# EAGLE design Nintendo64 (EAGLE 9.6.2)
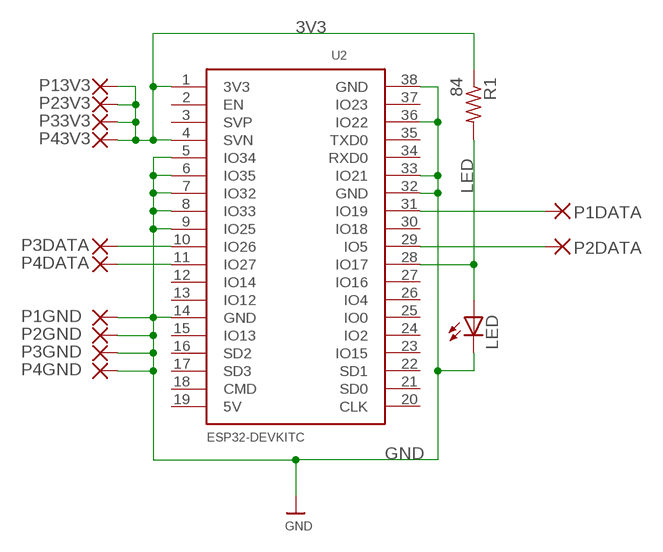
[diagram p0: schematic, sheet 1]

## Parts
LED  LEDCHIPLED_1206  [CHIPLED_1206]
P1DATA  SMD5  [SMD2,54-5,08]
P1GND  SMD5  [SMD2,54-5,08]
P2DATA  SMD5  [SMD2,54-5,08]
P2GND  SMD5  [SMD2,54-5,08]
P3DATA  SMD5  [SMD2,54-5,08]
P3GND  SMD5  [SMD2,54-5,08]
P4DATA  SMD5  [SMD2,54-5,08]
P4GND  SMD5  [SMD2,54-5,08]
P13V3  SMD5  [SMD2,54-5,08]
P23V3  SMD5  [SMD2,54-5,08]
P33V3  SMD5  [SMD2,54-5,08]
P43V3  SMD5  [SMD2,54-5,08]
R1  84  R-US_R1206  [R1206]
U2  ESP32DEVKITC  [ESP32-DEVKITC]

## Nets
3V3: P13V3.1(P) P23V3.1(P) P33V3.1(P) P43V3.1(P) R1.1 U2.1(3V3) U2.4(SVN)
GND: LED.C P1GND.1(P) P2GND.1(P) P3GND.1(P) P4GND.1(P) U2.5(IO34) U2.6(IO35) U2.7(IO32) U2.8(IO33) U2.9(IO25) U2.14(GND) U2.32(GND) U2.33(IO21) U2.36(IO22) U2.38(GND)
LED: LED.A R1.2 U2.28(IO17)
P1DATA: P1DATA.1(P) U2.31(IO19)
P2DATA: P2DATA.1(P) U2.29(IO5)
P3DATA: P3DATA.1(P) U2.10(IO26)
P4DATA: P4DATA.1(P) U2.11(IO27)
Unconnected: U2.2(EN) U2.3(SVP) U2.12(IO14) U2.13(IO12) U2.15(IO13) U2.16(SD2) U2.17(SD3) U2.18(CMD) U2.19(5V) U2.20(CLK) U2.21(SD0) U2.22(SD1) U2.23(IO15) U2.24(IO2) U2.25(IO0) U2.26(IO4) U2.27(IO16) U2.30(IO18) U2.34(RXD0) U2.35(TXD0) U2.37(IO23)

## Library data of the parts
LED = adafruit:LED: LED OSRAM: - CHIPLED LG R971, LG N971, LY N971, LG Q971, LY Q971, LO R971, LY R971 LH N974, LH R974 LS Q976, LO Q976, LY Q976 LO Q996 - Hyper CHIPLED LW Q18S LB Q993, LB Q99A, LB R99A - SideLED LS A670, LO A670, LY A670, LG A670, LP A670 LB A673, LV A673, LT A673, LW A673 LH A674 LY A675 LS A676, LA A676, LO A676, LY A676, LW A676 LS A679, LY A679, LG A679 - Hyper Micro SIDELED® LS Y876, LA Y876, LO Y876, LY Y876 LT Y87S - SmartLED LW L88C, LW L88S LB L89C, LB L89S, LG L890 LS L89K, LO L89K, LY L89K LS L896, LA L896, LO L896, LY L896 - TOPLED LS T670, LO T670, LY T670, LG T670, LP T670 LSG T670, LSP T670, LSY T670, LOP T670, LYG T670 LG T671, LOG T671, LSG T671 LB T673, LV T673, LT T673, LW T673 LH T674 LS T676, LA T676, LO T676, LY T676, LB T676, LH T676, LSB T676, LW T676 LB T67C, LV T67C, LT T67C, LS T67K, LO T67K, LY T67K, LW E67C LS E67B, LA E67B, LO E67B, LY E67B, LB E67C, LV E67C, LT E67C LW T67C LS T679, LY T679, LG T679 LS T770, LO T770, LY T770, LG T770, LP T770 LB T773, LV T773, LT T773, LW T773 LH T774 LS E675, LA E675, LY E675, LS T675 LS T776, LA T776, LO T776, LY T776, LB T776 LHGB T686 LT T68C, LB T68C - Hyper Mini TOPLED® LB M676 - Mini TOPLED Santana® LG M470 LS M47K, LO M47K, LY M47K Source: http://www.osram.convergy.de/
P1DATA P1GND P2DATA P2GND P3DATA P3GND P4DATA P4GND P13V3 P23V3 P33V3 P43V3 = wirepad:SMD5: SMD PAD
R1 = adafruit:R-US_: RESISTOR, American symbol
U2 = ESP32-DEVKITC4:ESP32DEVKITC

## Board
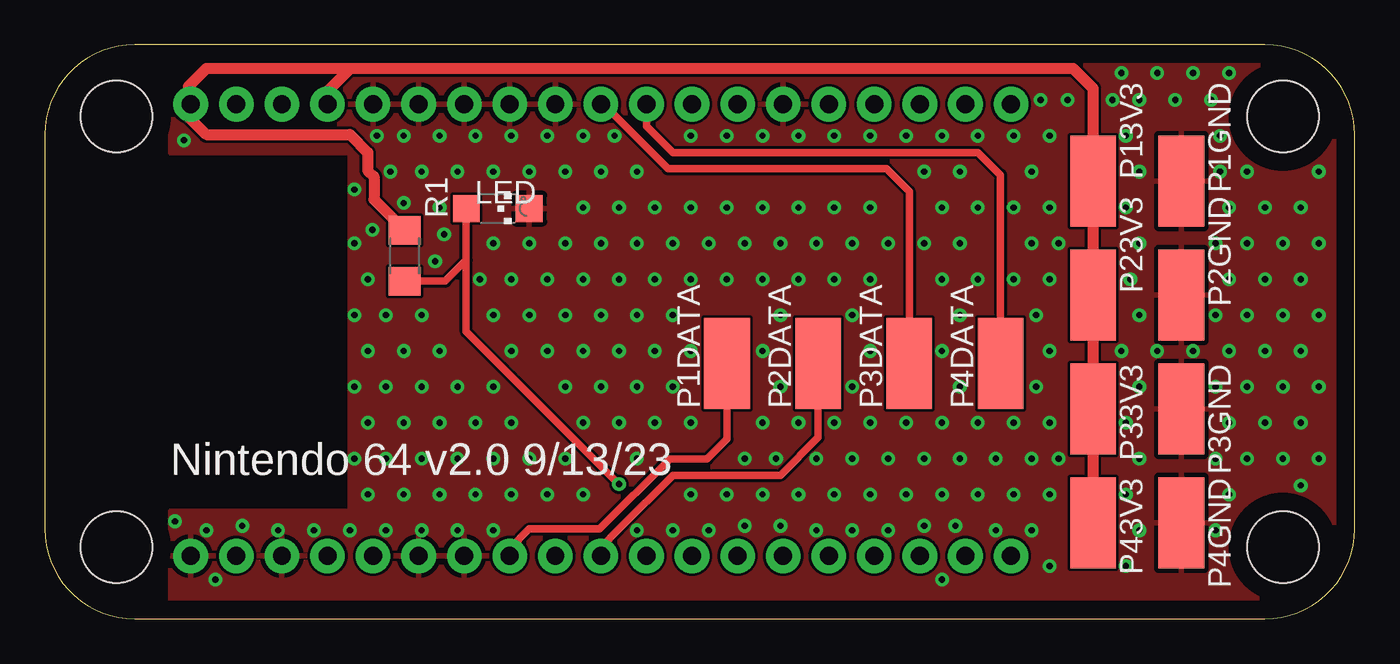
[diagram p1: board, top side]
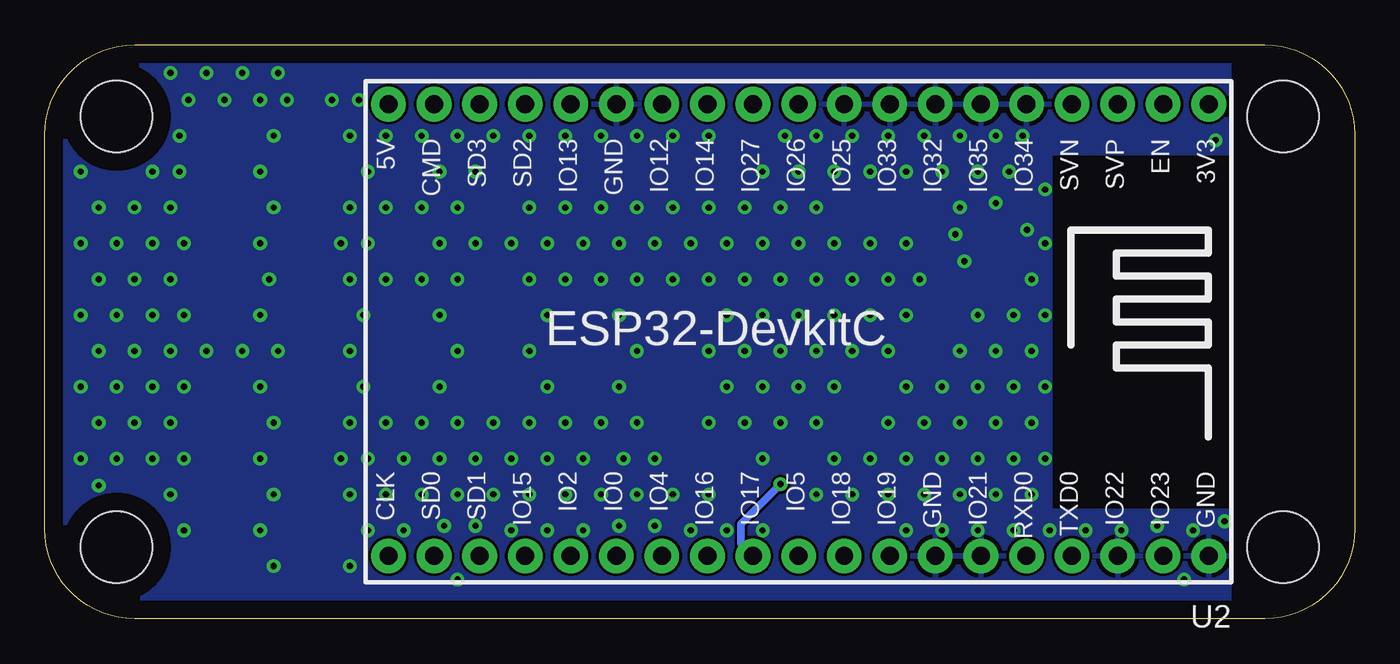
[diagram p2: board, bottom side, seen from below]

Size 73 x 32 mm. Coordinates in mm from the lower left corner, seen from the top.
Outline: 0,27 0,5 arc90 5,0 68,0 arc90 73,5 73,27 arc90 68,32 5,32 arc90 0,27
Copper layers (1*16): Top 0.035mm / dielectric 1.5mm / Bottom 0.035mm
Design rules "default": minimum track width 6mil, minimum drill 0.35mm, track to track 6mil, track to pad 6mil, pad to pad 6mil, via to via 6mil, smd to smd 6mil, copper to edge 40mil, drill to drill 6mil, minimum pad ring 10mil, minimum via ring 8mil, stop-mask expansion 4mil, vias tented up to drill 0.5mm, thermal gap 10mil
Holes 4 mm at 4,4 4,28 69,28 69,4

### Footprints (pad centres in the part's own frame; a part is rotated, then mirrored left to right if it is on the bottom)
CHIPLED_1206 = smd 1.5 x 1.5: A 0,-1.75; C 0,1.75
SMD2,54-5,08 = smd 2.54 x 5.08: 1 0,0
R1206 = smd 1.6 x 1.803: 1 -1.422,0; 2 1.422,0
ESP32-DEVKITC = drill 1 pad 1.93: 1 -22.87,-12.69; 2 -20.33,-12.69; 3 -17.79,-12.69; 4 -15.25,-12.69; 5 -12.71,-12.69; 6 -10.17,-12.69; 7 -7.63,-12.69; 8 -5.09,-12.69; 9 -2.55,-12.69; 10 -0.01,-12.69; 11 2.53,-12.69; 12 5.07,-12.69; 13 7.61,-12.69; 14 10.15,-12.69; 15 12.69,-12.69; 16 15.23,-12.69; 17 17.77,-12.69; 18 20.31,-12.69; 19 22.85,-12.69; 20 22.85,12.5; 21 20.31,12.5; 22 17.77,12.5; 23 15.23,12.5; 24 12.69,12.5; 25 10.15,12.5; 26 7.61,12.5; 27 5.07,12.5; 28 2.53,12.5; 29 -0.01,12.5; 30 -2.55,12.5; 31 -5.09,12.5; 32 -7.63,12.5; 33 -10.17,12.5; 34 -12.71,12.5; 35 -15.25,12.5; 36 -17.79,12.5; 37 -20.33,12.5; 38 -22.87,12.5

### Placement (x,y rotation side)
LED  25.24,22.87 270 top
P1DATA  38.02,14.24 0 top
P1GND  63.34,24.4 180 top
P2DATA  43.1,14.24 0 top
P2GND  63.34,18.05 180 top
P3DATA  48.18,14.24 0 top
P3GND  63.34,11.7 180 top
P4DATA  53.26,14.24 0 top
P4GND  63.34,5.35 180 top
P13V3  58.42,24.4 180 top
P23V3  58.42,18.05 180 top
P33V3  58.42,11.7 180 top
P43V3  58.42,5.35 180 top
R1  20.05,20.24 270 top
U2  31,16 180 bottom

### Tracks (layer width: path | path; a pad name or v marks a point on that pad's centre or on a via)
3V3
  Top 0.61: P43V3.1 P33V3.1 P23V3.1 P13V3.1 58.42,29.58 57.32,30.68 17,30.68 | R1.1 18.34,23.37 18.34,24.66 18,25 18,26 17,27 9,27 8,28 8,28.56 | 17,30.68 9,30.68 8,29.68 8,28.56 | 8,28.56 U2.1 | U2.4 15.75,29.43 17,30.68
GND  (via drill 0.35)
  other vias: 7.25,5.43 9.5,2.18 9,4.93 7.75,26.68 11,5.18 13,4.93 15,4.93 17,4.93 17.25,8.93 17.25,12.93 17.25,16.93 17.25,20.93 17.25,23.93 19,4.93 18,6.93 19,8.93 18,10.93 19,12.93 18,14.93 19,16.93 18,18.93 19.25,24.93 18.5,26.93 21,4.93 20,6.93 21,8.93 20,10.93 21,12.93 20,14.93 21,16.93 22.25,21.43 20,23.18 21,24.93 20,26.93 23,4.93 22,6.93 23,8.93 22,10.93 23,12.93 22,14.93 22,22.93 23,24.93 22,26.93 25,4.93 24,6.93 25,8.93 24,10.93 25,12.93 25,16.93 24.25,18.93 25,20.93 25,24.93 24,26.93 26,6.93 27,8.93 26,10.93 26,14.93 27,16.93 26,18.93 27,20.93 21.75,19.93 27,24.93 26,26.93 28,6.93 29,8.93 29,12.93 28,14.93 29,16.93 28,18.93 29,20.93 18.25,21.68 29,24.93 28,26.93 30,6.93 30,10.93 31,12.93 30,14.93 31,16.93 30,18.93 31,20.93 30,22.93 31,24.93 30,26.93 33,4.93 33,8.93 32,10.93 33,12.93 32,14.93 33,16.93 32,18.93 33,20.93 32,22.93 33,24.93 31.75,26.93 35,4.93 34,10.93 35,12.93 34,14.93 35,16.93 34,18.93 35,20.93 34,22.93 37,4.93 36,6.93 36,10.93 36,14.93 36,18.93 37,20.93 36,22.93 36,26.93 39,5.18 38,6.93 39,8.93 38,18.93 39,20.93 38,22.93 38,26.93 41,5.18 40,6.93 40.75,8.93 40,10.93 41,12.93 40,14.93 41,16.93 40,18.93 41,20.93 40,22.93 40,26.93 43,4.93 42,6.93 43,8.93 42,10.93 42,18.93 43,20.93 42,22.93 42,26.93 45,4.93 44,6.93 45,8.93 44,10.93 45,12.93 45,16.93 44,18.93 45,20.93 44,22.93 44,26.93 47,4.93 46,6.93 47,8.93 46,10.93 46,14.93 46,18.93 47,20.93 46,22.93 46,26.93 49,5.18 48,6.93 49,8.93 48,10.93 49,20.93 49,24.93 48,26.93 50,2.18 50.75,5.18 50,6.93 51,8.93 50,10.93 51,12.93 50,14.93 51,16.93 50,18.93 51,20.93 50,22.93 51,24.93 50,26.93 53,4.93 52,6.93 53,8.93 52,10.93 52,18.93 52,22.93 52,26.93 55,4.93 54,6.93 55,8.93 54,10.93 55.25,12.93 55.25,16.93 54,18.93 55,20.93 54,22.93 55,24.93 54,26.93 55.5,28.93 56,2.93 56,6.93 56.5,8.93 56,10.93 56,14.93 56,18.93 56.5,20.93 56,22.93 56,26.93 57,28.93 59.5,28.93 60.25,2.93 61,4.93 60.25,6.93 61,8.93 60.25,10.93 61,12.93 60,14.93 61,16.93 60.5,18.93 61,20.93 60.25,22.93 61,24.93 60.25,26.93 61,28.93 60,30.43 62,14.93 63,28.93 62,30.43 65.25,4.93 65.25,8.93 65.25,12.93 64,14.93 65.25,16.93 65.25,20.93 65.5,24.93 65,28.93 64,30.43 66,6.93 67,8.93 66,10.93 67,12.93 66,14.93 67,16.93 66,18.93 67,20.93 66,22.93 67,24.93 65.5,26.93 66,30.43 69,8.93 68,10.93 69,12.93 68,14.93 69,16.93 68,18.93 69,20.93 68,22.93 70,7.43 71,8.93 70,10.93 71,12.93 70,14.93 71,16.93 70,18.93 71,20.93 70,22.93 71,24.93
  pour Top: 7,32 7,26 17,26 17,6 7,6 7,0 73,0 73,32
  pour Bottom: 7,0 73,0 73,32 7,32 7,26 17,26 17,6 7,6
LED  (via drill 0.35)
  Top 0.406: v32,7.5 23.49,16.01 23.49,20 | 23.49,20 LED.A | R1.2 22.31,18.82 23.49,20
  Bottom 0.406: v32,7.5 34.2,5.3 34.2,4.17 U2.28
P1DATA
  Top 0.406: P1DATA.1 38.02,10.02 36.91,8.91 34.83,8.91 30.93,5 27,5 25.91,3.91 U2.31
P2DATA
  Top 0.406: P2DATA.1 43.1,10.1 41,8 35,8 32,5 30.99,3.99 U2.29
P3DATA
  Top 0.406: P3DATA.1 48.18,23.82 46.91,25.09 34.73,25.09 31.13,28.69 U2.10
P4DATA
  Top 0.406: P4DATA.1 53.26,24.74 52,26 35,26 33.53,27.47 U2.11

### Text on the board
tNames: Nintendo 64 v2.0 9/13/23